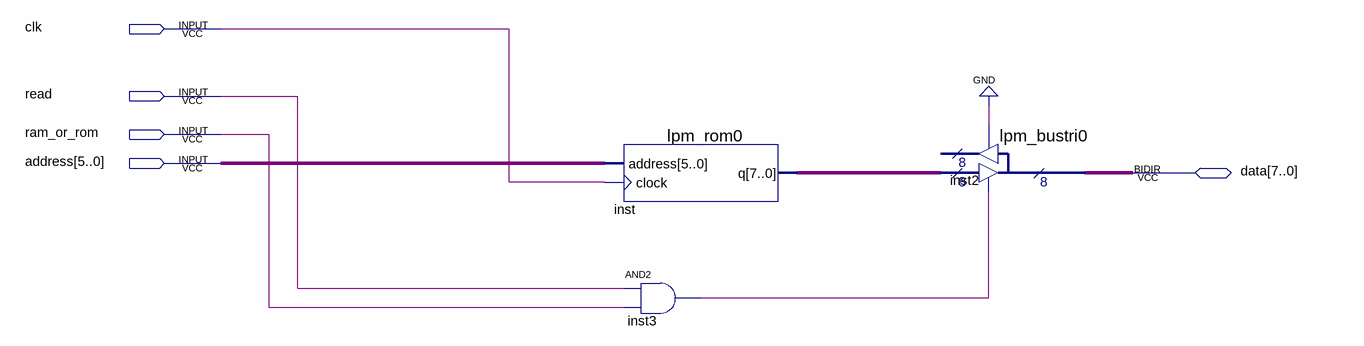
[diagram p0: schematic sheet]
// Quartus schematic ROM.bdf as structural Verilog: 3 symbols, 5 pins
module ROM (
  input  clk,
  input  read,
  input  ram_or_rom,
  input  [5:0] address,
  inout  [7:0] data
);

  wire inst3_out;
  wire [7:0] inst_q;

  lpm_rom0 inst (.address(address), .clock(clk), .q(inst_q));
  and inst3 (inst3_out, read, ram_or_rom);
  lpm_bustri0 inst2 (.enabledt(inst3_out), .data(inst_q), .enabletr(1'b0), .tridata(data));  // open: result
endmodule
